# EAGLE schematic BOTTOM-BOARD_SCH (EAGLE 9.6.2)
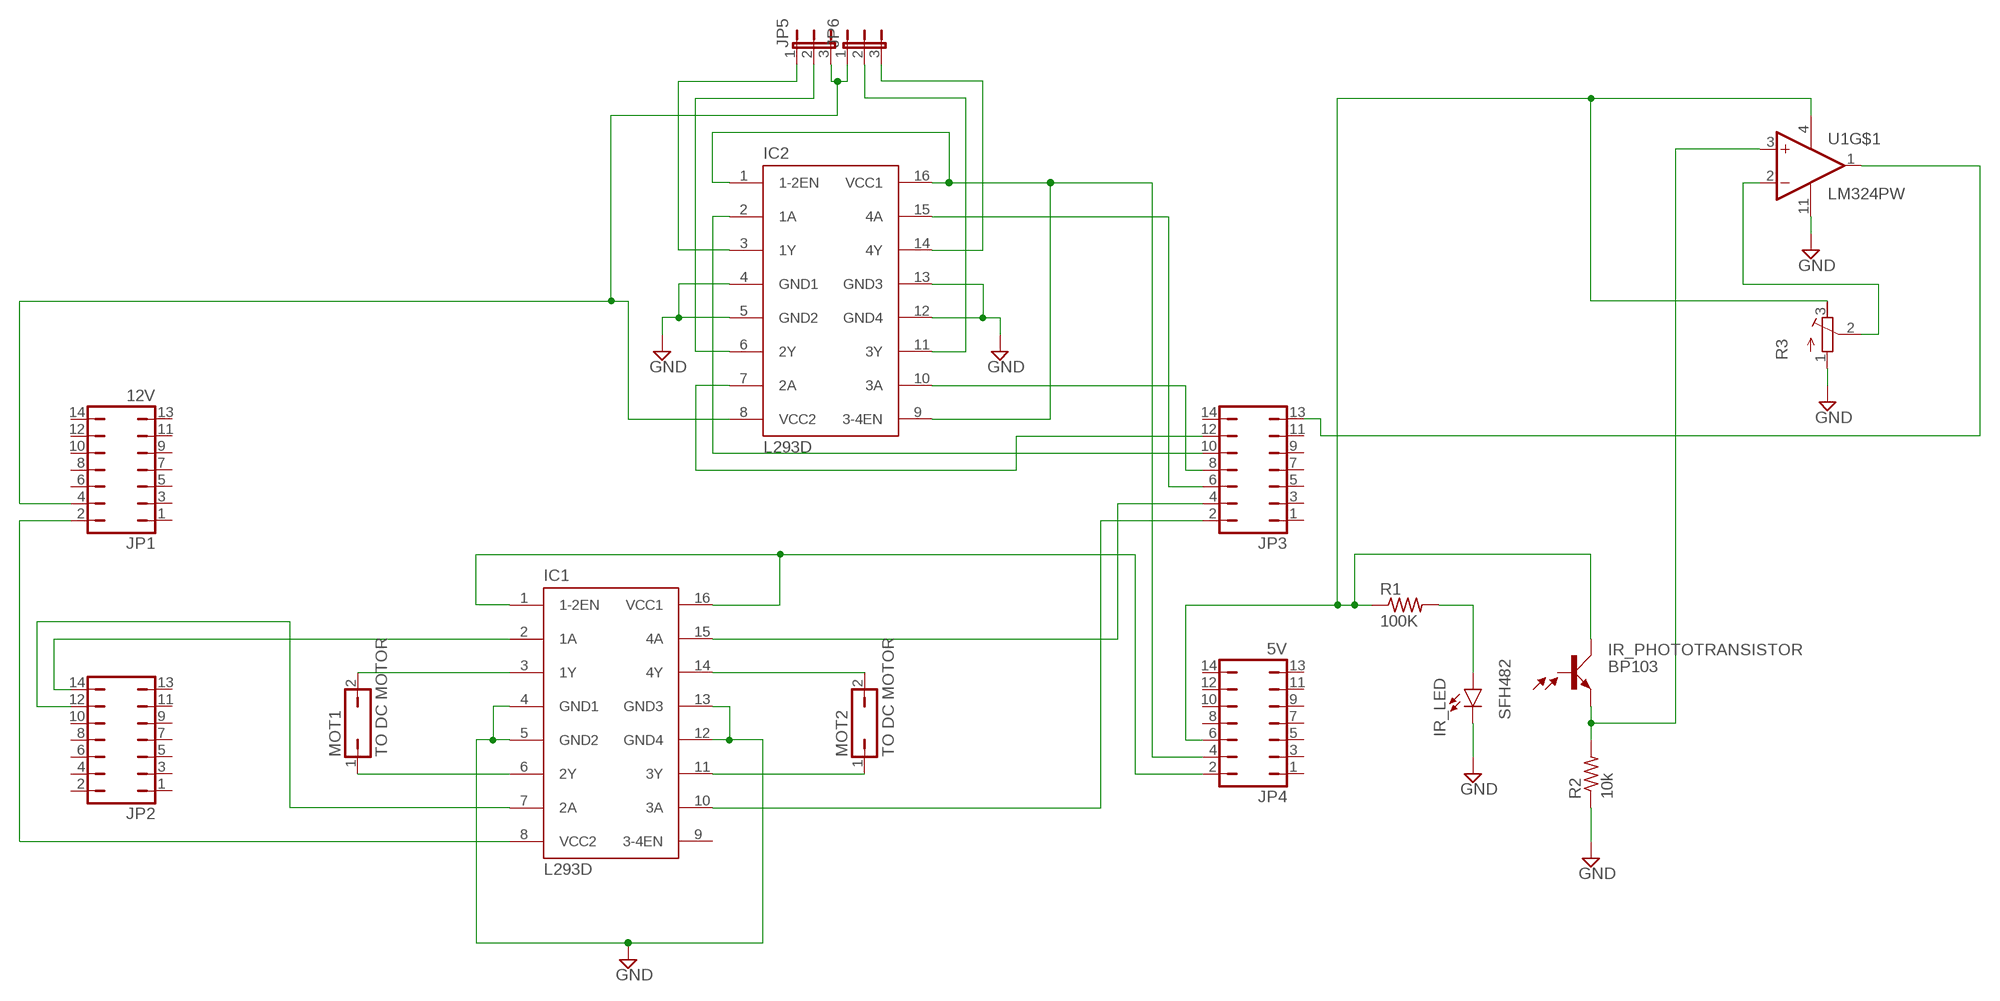
[diagram p0: schematic, sheet 1]

## Parts
IC1  L293D  [DIL16]
IC2  L293D  [DIL16]
IR_LED  SFH482  [SFH482]
IR_PHOTOTRANSISTOR  BP103  [BP103]
JP1  12V  JP7Q  [JP7Q]
JP2  JP7Q  [JP7Q]
JP3  JP7Q  [JP7Q]
JP4  5V  JP7Q  [JP7Q]
JP5  JP2E  [JP2]
JP6  JP2E  [JP2]
MOT1  TO DC MOTOR  JP1Q  [JP1]
MOT2  TO DC MOTOR  JP1Q  [JP1]
R1  100K  R-US_0204/5  [0204/5]
R2  10k  R-US_0204/5  [0204/5]
R3  R-TRIMMTSM53YL  [RTRIMTSM53YL]
U1  LM324PW  [SOP65P640X120-14N]

## Nets
GND: IC1.4(GND1) IC1.5(GND2) IC1.12(GND4) IC1.13(GND3) IC2.4(GND1) IC2.5(GND2) IC2.12(GND4) IC2.13(GND3) IR_LED.K(C) R2.1 R3.1(A) U1.11(GND)
N$1: IC1.3(1Y) MOT1.2
N$2: IC1.6(2Y) MOT1.1
N$3: IC1.11(3Y) MOT2.1
N$4: IC1.14(4Y) MOT2.2
N$5: IC1.2(1A) JP2.14
N$6: IC1.7(2A) JP2.12
N$7: IC1.1(1-2EN) IC1.16(VCC1) JP4.2
N$8: IC1.8(VCC2) JP1.2
N$9: IC2.3(1Y) JP5.1
N$10: IC2.6(2Y) JP5.2
N$11: IC2.14(4Y) JP6.3
N$12: IC2.11(3Y) JP6.2
N$13: IC2.7(2A) JP3.12
N$14: IC2.2(1A) JP3.10
N$15: IC2.10(3A) JP3.8
N$16: IC2.15(4A) JP3.6
N$17: IC1.10(3A) JP3.2
N$18: IR_PHOTOTRANSISTOR.C JP4.6 R1.1 R3.3(E) U1.4(VCC)
N$19: JP3.13 U1.1(OUT1)
N$20: R3.2(S) U1.2(-IN1)
N$21: IR_PHOTOTRANSISTOR.E R2.2 U1.3(+IN1)
N$22: IC2.1(1-2EN) IC2.9(3-4EN) IC2.16(VCC1) JP4.4
N$24: IR_LED.A R1.2
N$25: IC2.8(VCC2) JP1.4 JP5.3 JP6.1
N$26: IC1.15(4A) JP3.4
Unconnected: IC1.9(3-4EN) IR_PHOTOTRANSISTOR.B JP1.1 JP1.3 JP1.5 JP1.6 JP1.7 JP1.8 JP1.9 JP1.10 JP1.11 JP1.12 JP1.13 JP1.14 JP2.1 JP2.2 JP2.3 JP2.4 JP2.5 JP2.6 JP2.7 JP2.8 JP2.9 JP2.10 JP2.11 JP2.13 JP3.1 JP3.3 JP3.5 JP3.7 JP3.9 JP3.11 JP3.14 JP4.1 JP4.3 JP4.5 JP4.7 JP4.8 JP4.9 JP4.10 JP4.11 JP4.12 JP4.13 JP4.14 U1.5(+IN2) U1.6(-IN2) U1.7(OUT2) U1.8(OUT3) U1.9(-IN3) U1.10(+IN3) U1.12(+IN4) U1.13(-IN4) U1.14(OUT4)

## Library data of the parts
IC1 IC2 = st-microelectronics:L293D: PUSH-PULL 4 CHANNEL DRIVER; MPN: L293D; OC_FARNELL: 9589619; OC_NEWARK: 56P8249
IR_LED = led:SFH482: IR LED infrared emitting diode, Infineon
IR_PHOTOTRANSISTOR = opto-trans-siemens:BP103: PHOTO TRANSISTOR; OC_FARNELL: unknown; OC_NEWARK: unknown
JP1-JP4 = jumper:JP7Q: JUMPER
JP5 JP6 = jumper:JP2E: JUMPER
MOT1 MOT2 = jumper:JP1Q: JUMPER
R1 R2 = rcl:R-US_: RESISTOR, American symbol; SPICEPREFIX: R
R3 = rcl:R-TRIMM: Trimm resistor; SPICEMODEL: X; SPICEPREFIXL: POT
U1 = LM324PW:LM324PW: IC OPAMP LM324/TSSOP/LM324PW TEXAS INSTRUMENT RoHS TSSOP14 Check prices <https://pricing.snapeda.com/search/part/LM324PW/?ref=eda>; AVAILABILITY: Good; DESCRIPTION: 4-Channel industry standard operational amplifier 14-TSSOP 0 to 70; MF: Texas Instruments; MP: LM324PW; PACKAGE: TSSOP-14 Texas Instruments; PRICE: None; PURCHASE-URL: https://pricing.snapeda.com/search/part/LM324PW/?ref=eda